# Altium schematic sheet Sincronismo.SchDoc: PLACA POTÊNCIA REVISÃO C
size A3; DocumentNumber: GA0049; SheetNumber: 1; SheetTotal: 4; PageSetup: Record=PageOptions|CenterHorizontal=True|CenterVertical=True|PrintScale=0.71|XCorrection=1.00|YCorrection=1.00|PrintKind=0|BorderSize=5000000|LeftOffset=0|BottomOffset=0|Orientation=2|PaperLength=1000|PaperWidth=1000|Scale=100|PaperSource=7|PrintQuality=-3|MediaType=1|DitherType=10|PrintScaleMode=1|PaperKind=A4|PaperIndex=9
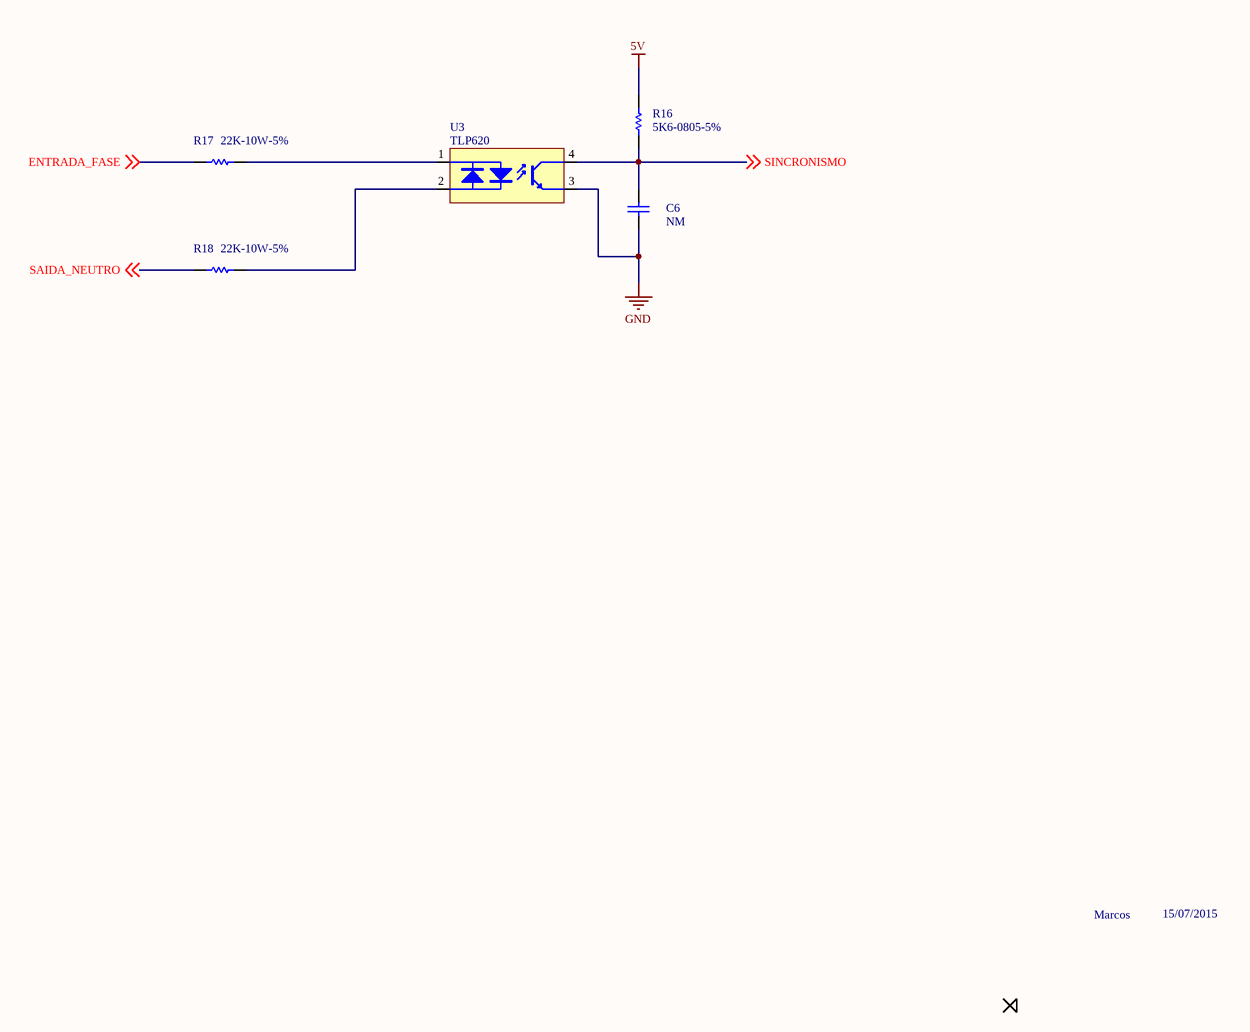
[diagram p0: Sincronismo.SchDoc]

## Parts
C6  NM  [0805-REVISADO ONDA]
R16  5K6-0805-5%  [0805-REVISADO ONDA]
R17  22K-10W-5%  [RESISTOR 10W CERAMICO]
R18  22K-10W-5%  [RESISTOR 10W CERAMICO]
U3  TLP620  [DIP-4]

## Nets
5V: R16.2
GND: C6.1 U3.3(E)
ENTRADA_FASE: R17.1 ; off-sheet ENTRADA_FASE
SAIDA_NEUTRO: R18.1 ; off-sheet SAIDA_NEUTRO
SINCRONISMO: C6.2 R16.1 U3.4(C) ; off-sheet SINCRONISMO
NetR17_2: R17.2 U3.1(A)
NetR18_2: R18.2 U3.2(K)

## Notes on the sheet
- Marcos
- 15/07/2015
- NOME
- DATA
- PROJETO
- DESCRIÇÃO
- www.quarktee.com.br
- desenho
- verif.
- aprov.
- TAMANHO
- CODIGO
- Todas as informações disponíveis
- não devem ser divulgadas,
- em parte ou todo.
- CIRCUITO IMPRESSO
- MONTAGEM ELETRÔNICA
- A4
- de

## Library data of the parts
C6 = 100nF/50-0805-NPO: ERP: 104.11.005
R16-R18 = 22K-0805-5%: ERP: 102.11.058
U3 = PC814